# EAGLE design breakout (EAGLE 6.5.0)
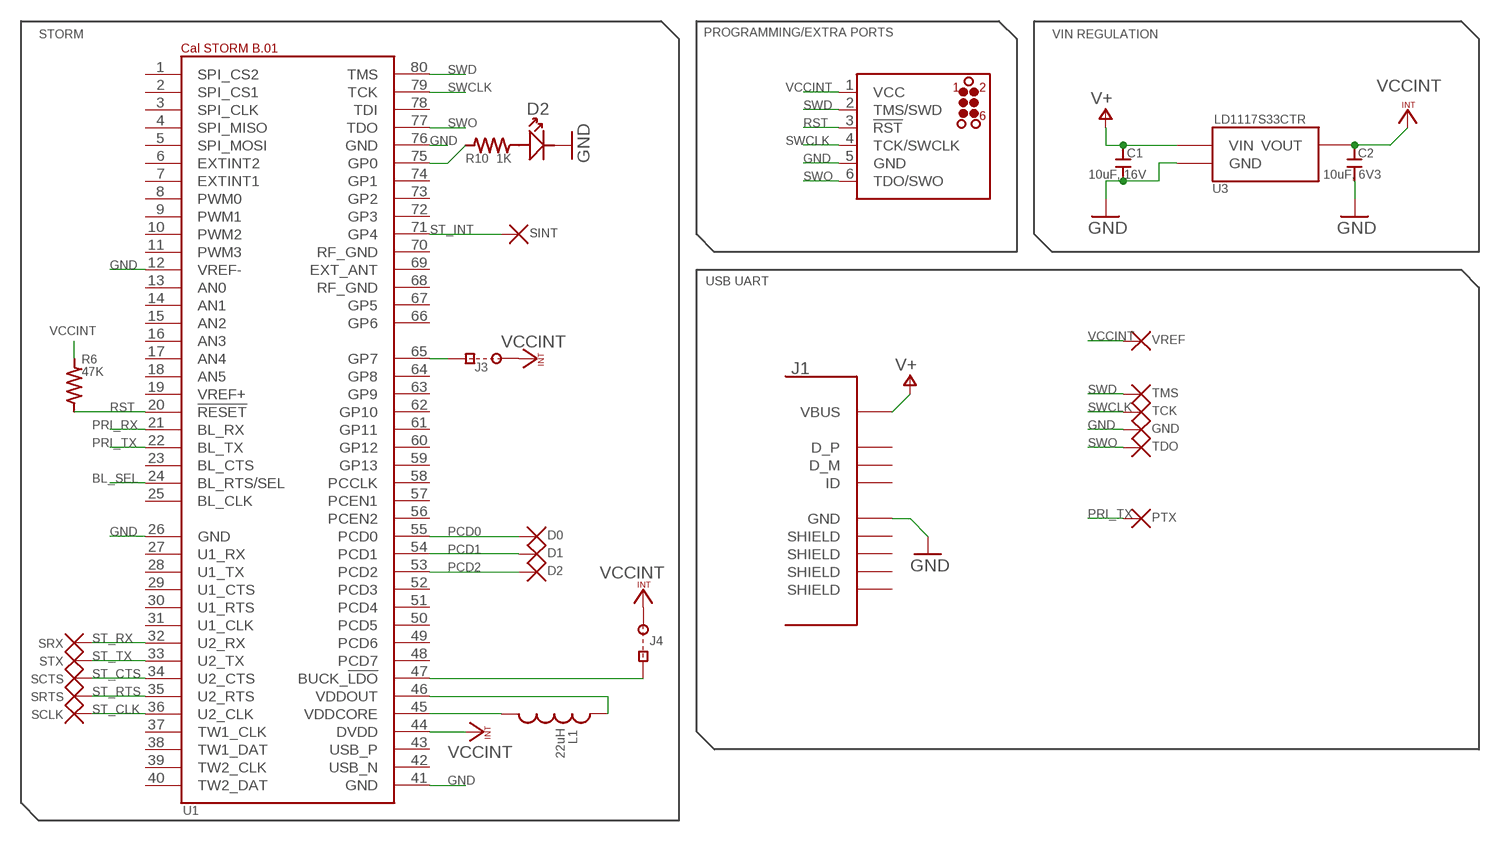
[diagram p0: schematic, sheet 1]

## Parts
C1  10uF, 16V  0805_CAPACITOR  [0805]
C2  10uF, 6V3  0603_CAPACITOR  [C0603]
D2  STATLED  [LINE_0805]
J1  USBSMT  [USB_SMT]
J3  CUTJ  [CUT]
J4  CUTJ  [CUT]
J8  JLINK_CONNECT  [TC2030-MCP-NL]
L1  22uH  SRN4018  [SRN4018]
R6  47K  0603_RESISTOR0402  [C0402]
R10  1K  0603_RESISTOR0402  [C0402]
TP1  VREF  TP  [TPP]
TP4  TMS  TP  [TPP]
TP5  TCK  TP  [TPP]
TP6  GND  TP  [TPP]
TP7  TDO  TP  [TPP]
TP10  D2  TP  [TPP]
TP11  D1  TP  [TPP]
TP12  D0  TP  [TPP]
TP13  SRX  TP  [TPP]
TP14  STX  TP  [TPP]
TP15  SCTS  TP  [TPP]
TP16  SRTS  TP  [TPP]
TP17  SCLK  TP  [TPP]
TP18  SINT  TP  [TPP]
TX  PTX  TP  [TPP]
U1  STORM_B.01  [STORM_LANDING]
U3  LD1117S33CTR_3V3_REG  [SOT223]

## Nets
BL_SEL: U1.24(BL_RTS/SEL)
GND: C1.1 C2.1 D2.LINE(-) J1.5GND(GND) J8.5(GND) TP6.P$1 U1.12(VREF-) U1.26(GND) U1.41(GND) U1.76(GND) U3.1(GND)
N$7: L1.P$2 U1.45(VDDCORE)
N$11: J3.SQ U1.65(GP7)
N$20: L1.P$1 U1.46(VDDOUT)
N$21: R10.1 U1.75(GP0)
N$22: J4.SQ U1.47(BUCK_!LDO!)
N$24: D2.NOLINE(+) R10.2
PCD0: TP12.P$1 U1.55(PCD0)
PCD1: TP11.P$1 U1.54(PCD1)
PCD2: TP10.P$1 U1.53(PCD2)
PRI_RX: U1.21(BL_RX)
PRI_TX: TX.P$1 U1.22(BL_TX)
RST: J8.3(!RST!) R6.2 U1.20(!RESET!)
ST_CLK: TP17.P$1 U1.36(U2_CLK)
ST_CTS: TP15.P$1 U1.34(U2_CTS)
ST_INT: TP18.P$1 U1.71(GP4)
ST_RTS: TP16.P$1 U1.35(U2_RTS)
ST_RX: TP13.P$1 U1.32(U2_RX)
ST_TX: TP14.P$1 U1.33(U2_TX)
SWCLK: J8.4(TCK/SWCLK) TP5.P$1 U1.79(TCK)
SWD: J8.2(TMS/SWD) TP4.P$1 U1.80(TMS)
SWO: J8.6(TDO/SWO) TP7.P$1 U1.77(TDO)
V+: C1.2 J1.1VBUS(VBUS) U3.3(VIN)
VCCINT: C2.2 J3.R J4.R J8.1(VCC) R6.1 TP1.P$1 U1.44(DVDD) U3.2(VOUT)
Unconnected: J1.2D-(D_M) J1.3D+(D_P) J1.4ID(ID) J1.SHIELD@1(SHIELD) J1.SHIELD@2(SHIELD) J1.SHIELD@3(SHIELD) J1.SHIELD@4(SHIELD) U1.1(SPI_CS2) U1.2(SPI_CS1) U1.3(SPI_CLK) U1.4(SPI_MISO) U1.5(SPI_MOSI) U1.6(EXTINT2) U1.7(EXTINT1) U1.8(PWM0) U1.9(PWM1) U1.10(PWM2) U1.11(PWM3) U1.13(AN0) U1.14(AN1) U1.15(AN2) U1.16(AN3) U1.17(AN4) U1.18(AN5) U1.19(VREF+) U1.23(BL_CTS) U1.25(BL_CLK) U1.27(U1_RX) U1.28(U1_TX) U1.29(U1_CTS) U1.30(U1_RTS) U1.31(U1_CLK) U1.37(TW1_CLK) U1.38(TW1_DAT) U1.39(TW2_CLK) U1.40(TW2_DAT) U1.42(USB_N) U1.43(USB_P) U1.48(PCD7) U1.49(PCD6) U1.50(PCD5) U1.51(PCD4) U1.52(PCD3) U1.56(PCEN2) U1.57(PCEN1) U1.58(PCCLK) U1.59(GP13) U1.60(GP12) U1.61(GP11) U1.62(GP10) U1.63(GP9) U1.64(GP8) U1.66(GP6) U1.67(GP5) U1.68(RF_GND) U1.69(EXT_ANT) U1.70(RF_GND) U1.72(GP3) U1.73(GP2) U1.74(GP1) U1.78(TDI)

## Notes on the sheet
- STORM | PROGRAMMING/EXTRA PORTS | VIN REGULATION
- USB UART

## Library data of the parts
C1 = storm:0805_CAPACITOR
C2 = storm:0603_CAPACITOR
D2 = storm:STATLED
J1 = storm:USB
J3 J4 = storm:CUTJ
J8 = storm:JLINK_CONNECT
L1 = storm:SRN4018
R6 R10 = storm:0603_RESISTOR
TP1 TP4-TP7 TP10-TP18 TX = storm:TP
U1 = storm:STORM_B.01
U3 = storm:LD1117S33CTR_3V3_REG

## Net classes
0 default: width 0.203 mm

## Board
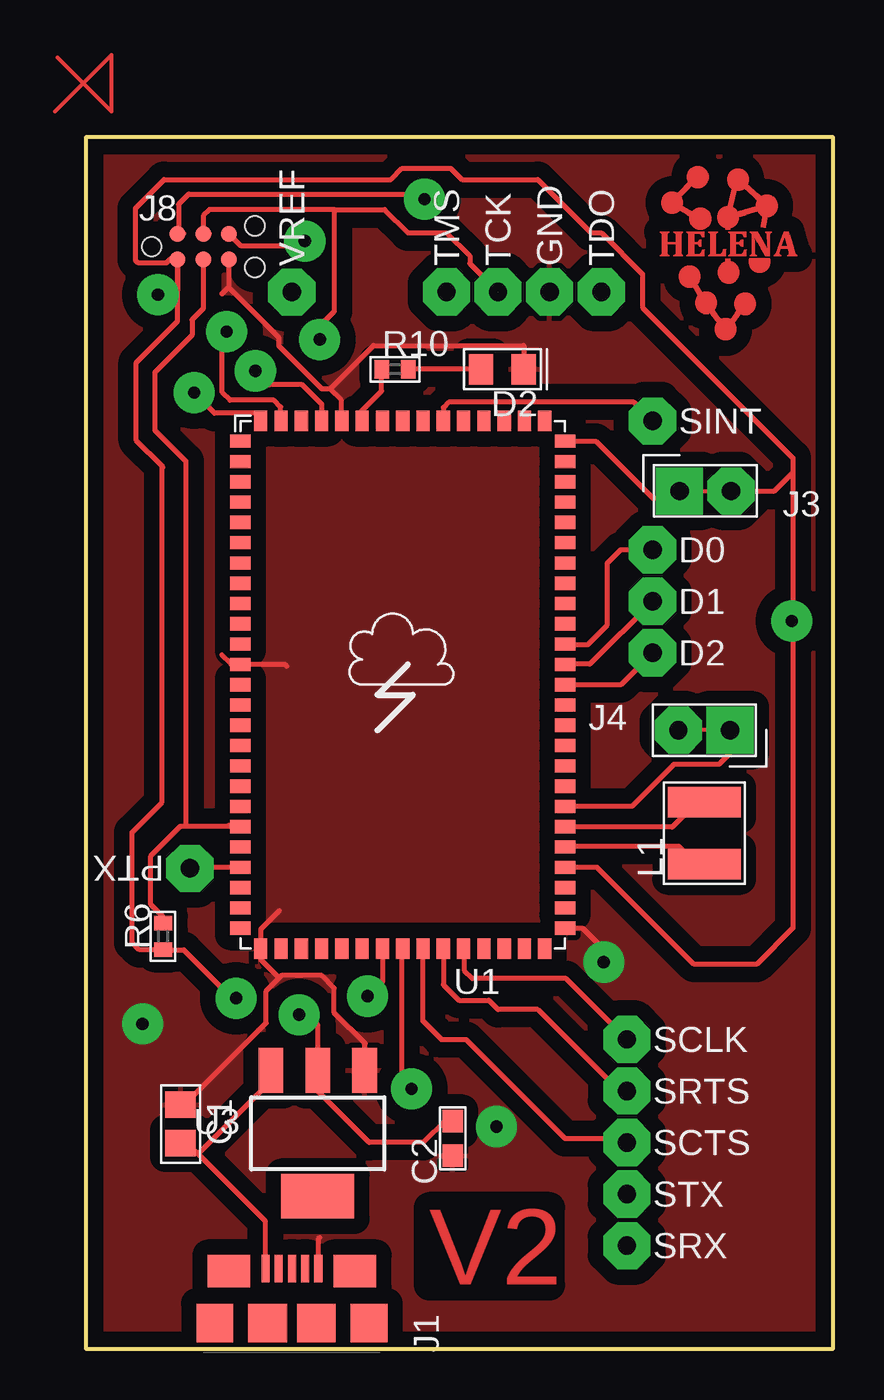
[diagram p1: board, top side]
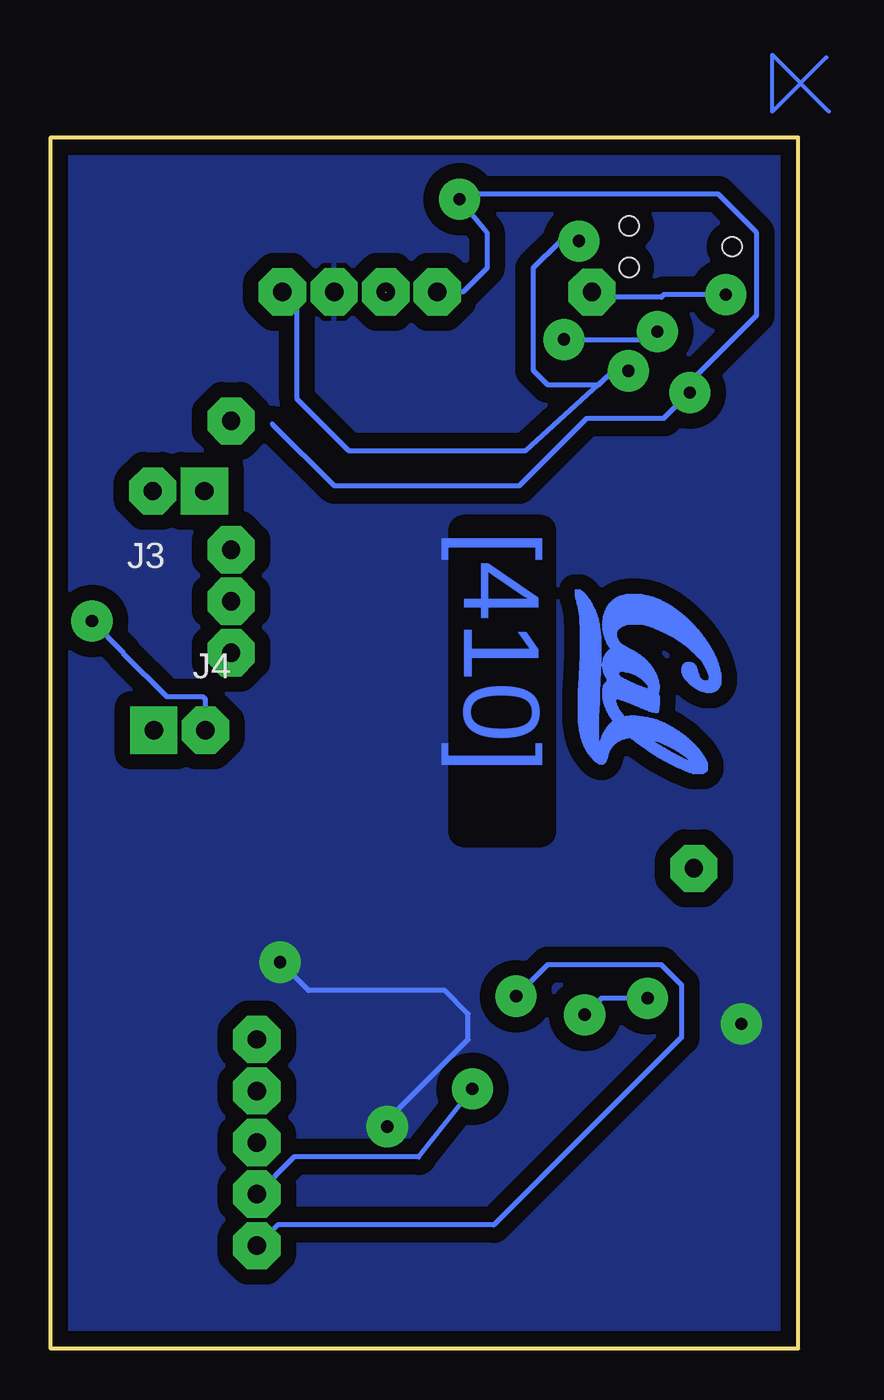
[diagram p2: board, bottom side, seen from below]

Size 36.83 x 59.69 mm. Coordinates in mm from the lower left corner, seen from the top.
Outline: 0,59.69 0,0 36.83,0 36.83,59.69 0,59.69
Copper layers (1*16): Top 0.035mm / dielectric 1.5mm / Bottom 0.035mm
Design rules "etchingrules": minimum track width 10mil, minimum drill 0.6mm, track to track 10mil, track to pad 10mil, pad to pad 10mil, via to via 10mil, smd to smd 0mil, copper to edge 8mil, drill to drill 8mil, minimum pad ring 28mil, minimum via ring 28mil, stop-mask expansion 4mil, vias tented up to drill 0mil, thermal gap 10mil

### Footprints (pad centres in the part's own frame; a part is rotated, then mirrored left to right if it is on the bottom)
0805 = smd 1.3 x 1.5: 1 -0.95,0; 2 0.95,0
C0603 = smd 1.1 x 1: 1 -0.85,0; 2 0.85,0
LINE_0805 = smd 1.2 x 1.5: LINE 0,0; NOLINE 2.11,0
USB_SMT = smd 0.4 x 1.35: 1VBUS -1.3,2.675; 2D- -0.65,2.675; 3D+ 0,2.675; 4ID 0.65,2.675; 5GND 1.3,2.675 | smd 2.1 x 1.6: SHIELD@1 -3.1,2.55; SHIELD@6 3.1,2.55 | smd 1.8 x 1.9: SHIELD@2 -3.8,0; SHIELD@5 3.8,0 | smd 1.9 x 1.9: SHIELD@3 -1.2,0; SHIELD@4 1.2,0
CUT = drill 0.9 octagon: R 1.27,0 | drill 0.9 square: SQ -1.27,0
TC2030-MCP-NL = smd 0.787 x 0.787: 1 1.27,-0.635; 2 1.27,0.635; 3 2.54,-0.635; 4 2.54,0.635; 5 3.81,-0.635; 6 3.81,0.635 | hole 0.95: 0,0; 5.08,-1.016; 5.08,1.016
SRN4018 = smd 1.5 x 3.6: P$1 -1.525,0; P$2 1.525,0
C0402 = smd 0.7 x 0.9: 1 -0.65,0; 2 0.65,0
TPP = drill 0.9 octagon: P$1 0,0
STORM_LANDING = smd 1 x 0.65: 1 0,-1; 2 0,-2; 3 0,-3; 4 0,-4; 5 0,-5; 6 0,-6; 7 0,-7; 8 0,-8; 9 0,-9; 10 0,-10; 11 0,-11; 12 0,-12; 13 0,-13; 14 0,-14; 15 0,-15; 16 0,-16; 17 0,-17; 18 0,-18; 19 0,-19; 20 0,-20; 21 0,-21; 22 0,-22; 23 0,-23; 24 0,-24; 25 0,-25; 41 16,-25; 42 16,-24; 43 16,-23; 44 16,-22; 45 16,-21; 46 16,-20; 47 16,-19; 48 16,-18; 49 16,-17; 50 16,-16; 51 16,-15; 52 16,-14; 53 16,-13; 54 16,-12; 55 16,-11; 56 16,-10; 57 16,-9; 58 16,-8; 59 16,-7; 60 16,-6; 61 16,-5; 62 16,-4; 63 16,-3; 64 16,-2; 65 16,-1 | smd 0.65 x 1: 26 1,-26; 27 2,-26; 28 3,-26; 29 4,-26; 30 5,-26; 31 6,-26; 32 7,-26; 33 8,-26; 34 9,-26; 35 10,-26; 36 11,-26; 37 12,-26; 38 13,-26; 39 14,-26; 40 15,-26; 66 15,0; 67 14,0; 68 13,0; 69 12,0; 70 11,0; 71 10,0; 72 9,0; 73 8,0; 74 7,0; 75 6,0; 76 5,0; 77 4,0; 78 3,0; 79 2,0; 80 1,0
SOT223 = smd 1.219 x 2.235: 1 -2.311,-3.099; 2 0,-3.099; 3 2.311,-3.099 | smd 3.6 x 2.2: 4 0,3.099

### Placement (x,y rotation side)
C1  4.67,11.07 270 top
C2  18.08,10.36 90 top
D2  21.59,48.26 180 top
J1  10.16,1.27 0 top
J3  30.53,42.27 0 top
J4  30.48,30.48 180 top
J8  3.25,54.31 0 top
L1  30.48,25.4 270 top
R6  3.81,20.32 90 top
R10  15.24,48.26 0 top
TP1  10.15,52.07 90 top
TP4  17.78,52.07 90 top
TP5  20.31,52.07 90 top
TP6  22.86,52.07 90 top
TP7  25.41,52.08 90 top
TP10  27.94,34.29 0 top
TP11  27.94,36.83 0 top
TP12  27.94,39.37 0 top
TP13  26.67,5.08 0 top
TP14  26.67,7.62 0 top
TP15  26.67,10.16 0 top
TP16  26.67,12.7 0 top
TP17  26.67,15.24 0 top
TP18  27.94,45.72 0 top
TX  5.13,23.67 180 top
U1  7.62,45.72 0 top
U3  11.43,10.62 180 top

### Tracks (layer width: path | path; a pad name or v marks a point on that pad's centre or on a via)
GND  (via drill 0.6)
  Top 0.254: U1.41 23.62,20.68 23.65,20.7 24.51,20.7 25.53,19.68 v25.53,19.05 | J1.5GND 11.48,3.96 11.48,5.44 11.53,5.49 | D2.LINE 21.59,49.43 14.17,49.43 12.04,47.3 | 7.06,52.32 7.06,52.27 9.52,49.81 9.52,49.4 11.63,47.3 12.04,47.3 | 7.06,52.32 J8.5 | 12.04,47.3 12.6,46.74 12.6,45.72 U1.76 | C1.1 4.67,12.04 4.88,12.04 8.89,16.05 8.89,17.63 9.52,18.26 | 6.71,34.19 7.16,33.73 7.57,33.73 U1.12 9.8,33.73 9.91,33.63 | U3.1 13.77,13.77 13.77,15.04 12.24,16.56 12.24,17.78 11.63,18.39 9.65,18.39 | 6.71,51.97 7.06,52.32 | 9.52,18.26 9.65,18.39 | 9.6,18.39 9.65,18.39 | 9.52,18.26 8.64,19.15 8.64,19.66 U1.26 8.64,19.76 8.64,20.68 9.55,21.59
  Bottom 0.254: v20.24,10.95 19.69,11.81 16.26,15.24 16.26,16.51 17.4,17.65 24.13,17.65 v25.53,19.05
  other vias: 2.79,16
  pour Top (isolate 0.762): 0.13,59.56 36.7,59.56 36.7,0.13 0,0.13 0,59.56
  pour Bottom (isolate 0.762): 0,59.56 36.7,59.56 36.7,0.13 0,0.13
N$1
  Bottom 0.203: -1.4,63.63 1.27,60.96 1.27,63.75 -1.52,60.96
N$2
  Top 0.203: -1.4,63.63 1.27,60.96 1.27,63.75 -1.52,60.96
N$7
  Top 0.254: U1.45 23.62,24.74 29.26,24.74 30.12,23.88 L1.P$2
N$11
  Top 0.254: U1.65 25.13,44.72 27.94,41.91 28.91,41.91 J3.SQ
N$20
  Top 0.254: U1.46 23.62,25.71 28.91,25.71 30.12,26.92 L1.P$1
N$21
  Top 0.254: R10.1 14.58,47.19 13.61,46.23 U1.75
N$22
  Top 0.254: U1.47 26.92,26.72 29.01,28.8 31.22,28.8 31.75,29.34 J4.SQ
  Bottom 0.254: J4.SQ 31.75,30.43
N$24
  Top 0.254: D2.NOLINE R10.2
PCD0
  Top 0.254: 27.94,38.76 TP12.P$1 26.37,39.37 25.7,38.71 25.7,35.66 24.74,34.7 23.62,34.7 U1.55
PCD1
  Top 0.254: TP11.P$1 24.84,33.73 U1.54
PCD2
  Top 0.254: TP10.P$1 26.37,32.72 U1.53
PRI_TX
  Top 0.254: U1.22 5.18,23.72 TX.P$1
RST
  Top 0.254: U1.20 7.62,25.71 7.16,25.71 7.06,25.81 7.01,25.76 4.98,25.76 | J8.3 5.79,51.26 5.23,50.7 5.23,49.94 3.4,48.11 3.4,45.26 4.93,43.74 4.93,25.81 4.98,25.76 | R6.2 3.81,21.29 3.2,21.89 3.2,24.28 4.67,25.76 4.98,25.76
ST_CLK
  Top 0.254: U1.36 18.64,19.71 18.64,18.64 19.05,18.24 23.67,18.24 TP17.P$1
ST_CTS
  Top 0.254: U1.34 16.61,16.15 17.53,15.24 18.74,15.24 23.62,10.36 26.47,10.36 TP15.P$1
ST_INT
  Top 0.254: U1.71 17.63,46.38 17.88,46.63 27.02,46.63 TP18.P$1
ST_RTS
  Top 0.254: U1.35 17.63,17.93 18.39,17.17 19.86,17.17 20.32,16.71 22.28,16.71 26.29,12.7 TP16.P$1
ST_RX  (via drill 0.6)
  Top 0.254: 14.63,20.02 14.63,19.76 | 14.63,19.76 U1.32 | 14.63,19.76 14.63,18.11 v13.89,17.37
  Bottom 0.254: v13.89,17.37 12.34,18.92 6.73,18.92 5.74,17.93 5.74,15.34 14.99,6.1 25.65,6.1 TP13.P$1
ST_TX  (via drill 0.6)
  Top 0.254: v16.05,12.8 15.6,13.06 15.6,19.71 U1.33
  Bottom 0.254: v16.05,12.8 18.69,9.45 24.84,9.45 TP14.P$1
SWCLK  (via drill 0.6)  (1 unrouted)
  Top 0.254: 6.1,54.97 5.79,54.97 J8.4 5.79,55.83 6.1,56.13 12.24,56.13 | 12.24,56.13 12.24,51.11 11.12,49.99 v11.53,49.73 | U1.79 9.6,45.72 9.6,46.41 9.27,46.74 7.11,46.74 6.73,47.12 6.73,49.91 v6.93,50.11 | 12.24,56.13 14.73,56.13 15.88,54.99 17.78,54.99 18.92,53.85 18.92,53.47 TP5.P$1
  Bottom 0.254: v11.53,49.73 7.31,49.73 v6.93,50.11
SWD  (via drill 0.6)
  Top 0.254: 4.83,54.97 4.52,54.97 J8.2 4.57,54.99 4.57,56.39 5.08,56.9 16.13,56.9 v16.69,56.64 16.92,56.49 | 8.64,45.42 8.64,45.72 U1.80 8.64,45.74 8.64,46.1 6.35,46.1 v5.33,47.12
  Bottom 0.254: 25.91,45.57 22.86,42.52 13.74,42.52 10.41,45.85 6.6,45.85 v5.33,47.12 5.84,47.12 2.03,50.93 2.03,54.99 3.94,56.9 16.13,56.9 v16.69,56.64 15.34,55.02 15.34,53.24 16.51,52.07 | 16.51,52.07 | 16.51,52.07 TP4.P$1
SWO  (via drill 0.6)
  Top 0.254: 7.06,54.97 J8.6 7.06,54.92 7.62,54.36 10.41,54.36 10.72,54.66 | U1.77 11.63,45.72 11.63,46.53 10.67,47.5 9.04,47.5 v8.36,48.18 | 10.41,54.97 10.72,54.66 | 10.72,54.66 v10.8,54.59
  Bottom 0.254: TP7.P$1 24.69,51.62 24.69,46.79 22.15,44.25 13.44,44.25 9.28,48.02 8.52,48.02 v8.36,48.18 8.38,48.16 9.14,48.16 9.8,47.5 12.34,47.5 13.06,48.21 13.06,53.24 11.68,54.61 10.82,54.61 v10.8,54.59
V+
  Top 0.254: 5.54,9.6 5.03,10.11 4.67,10.11 C1.2 | 5.54,9.6 8.84,6.3 8.84,3.96 J1.1VBUS | 5.54,9.6 9.14,13.21 9.14,13.72 U3.3
VCCINT  (via drill 0.6)
  Top 0.254: J8.1 4.52,50.62 2.49,48.59 2.49,44.75 3.76,43.48 | 34.85,43.18 34.85,43.89 27.43,51.31 27.43,52.96 25.4,54.99 24.89,54.99 22.28,57.61 18.54,57.61 17.98,58.17 15.6,58.17 15.04,57.61 3.86,57.61 2.44,56.19 2.44,53.64 2.59,53.49 3.96,53.49 4.17,53.7 4.47,53.7 J8.1 | 34.85,43.18 34.85,35.86 | 34.85,35.86 34.85,20.73 33.07,18.95 29.97,18.95 25.2,23.72 U1.44 | v7.42,17.27 7.21,17.27 4.83,19.66 3.86,19.66 R6.1 2.64,19.66 2.29,20.02 2.29,25.45 3.76,26.92 3.76,43.48 | v34.8,35.86 34.85,35.86 | v10.52,16.46 10.92,16.46 11.43,15.95 U3.2 11.43,12.7 13.97,10.16 16.64,10.16 17.74,11.26 18.14,11.26 C2.2 | J3.R 33.93,42.27 34.85,43.18 | J8.1 4.52,52.15 4.45,52.07 3.68,52.07 v3.56,51.94 | 3.81,43.43 3.76,43.48
  Bottom 0.254: v34.8,35.86 33.27,34.34 33.27,34.29 31.12,32.13 29.34,32.13 29.21,32 J4.R | v7.42,17.27 9.7,17.27 v10.52,16.46 | v3.56,51.94 6.6,51.94 6.73,51.82 10.15,51.82 TP1.P$1
(copper drawn outside any net)
  shapes: Bottom area x1091, Top area x1119

### Text on the board
Top: V2
Bottom: [410]